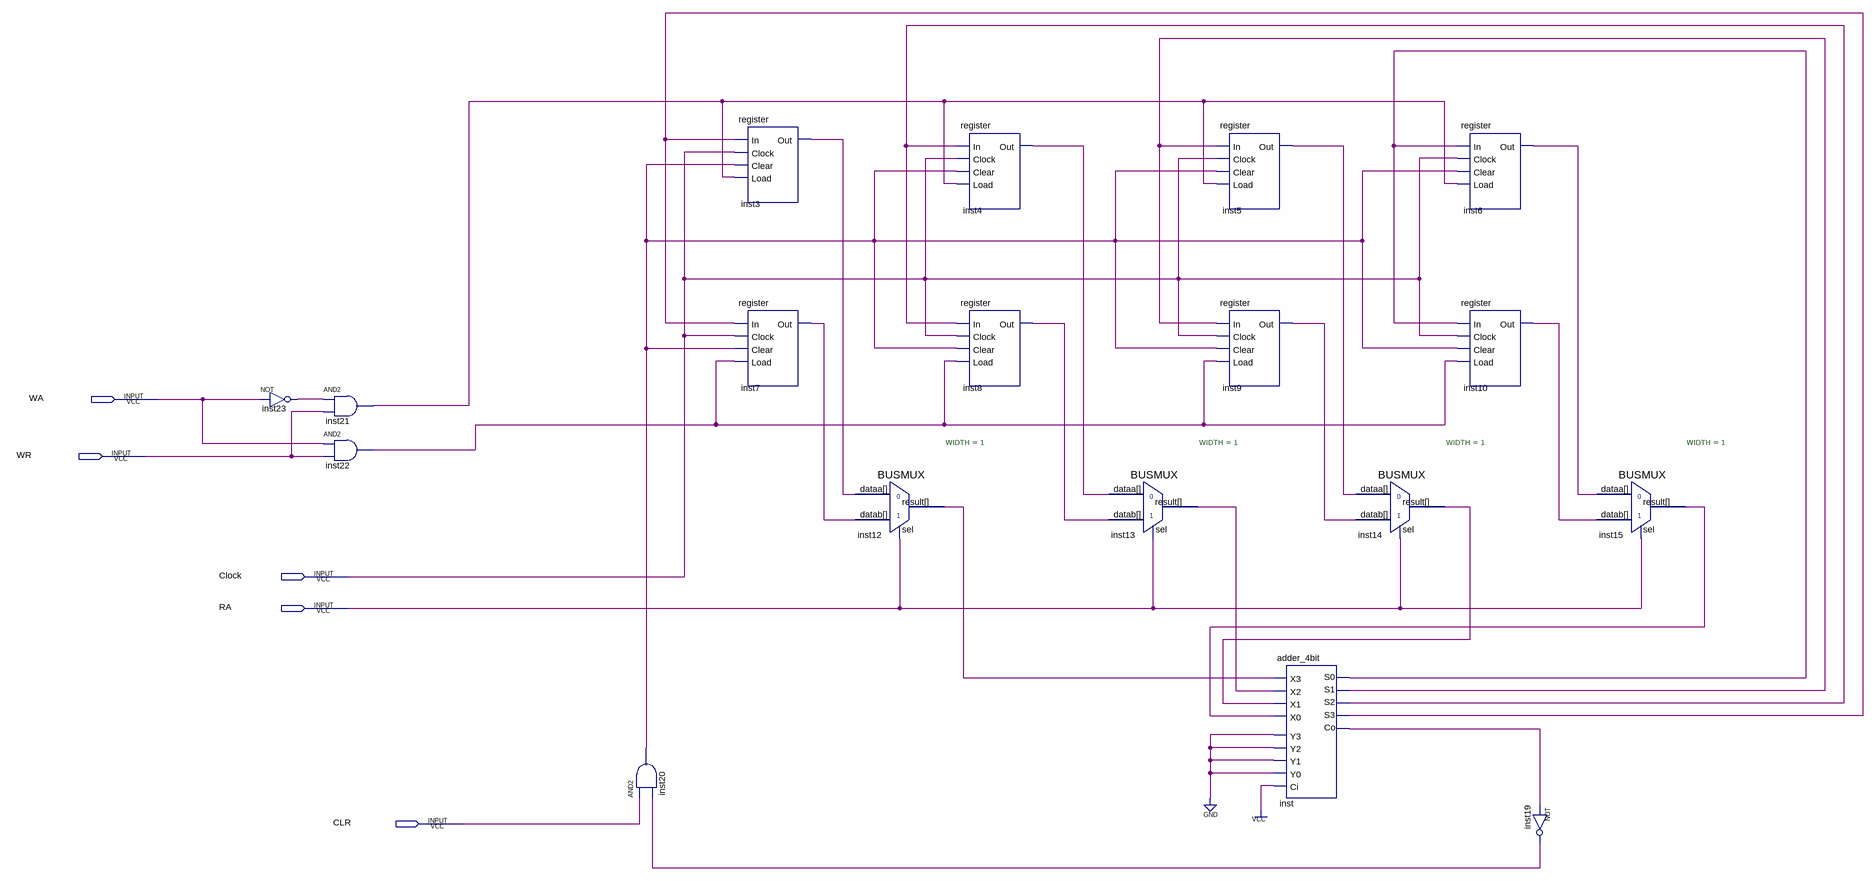
[diagram p0: schematic sheet]
// Quartus schematic Block4.bdf as structural Verilog: 18 symbols, 5 pins
module Block4 (
  input  WA,
  input  WR,
  input  Clock,
  input  RA,
  input  CLR
);

  wire inst3_out, inst4_out, inst5_out, inst6_out, inst7_out, inst8_out, inst9_out, inst10_out,
       inst12_result, inst13_result, inst14_result, inst15_result, inst19_out, inst20_out, inst21_out,
       inst22_out, inst23_out, inst_co, inst_s0, inst_s1, inst_s2, inst_s3;

  not inst23 (inst23_out, WA);
  and inst21 (inst21_out, inst23_out, WR);
  and inst22 (inst22_out, WA, WR);
  and inst20 (inst20_out, CLR, inst19_out);
  register inst3 (.In(inst_s3), .Clock(Clock), .Clear(inst20_out), .Load(inst21_out), .Out(inst3_out));
  register inst7 (.In(inst_s3), .Clock(Clock), .Clear(inst20_out), .Load(inst22_out), .Out(inst7_out));
  BUSMUX #(.WIDTH(1)) inst12 (.datab(inst7_out), .sel(RA), .dataa(inst3_out), .result(inst12_result));
  register inst4 (.In(inst_s2), .Clock(Clock), .Clear(inst20_out), .Load(inst21_out), .Out(inst4_out));
  register inst8 (.In(inst_s2), .Clock(Clock), .Clear(inst20_out), .Load(inst22_out), .Out(inst8_out));
  BUSMUX #(.WIDTH(1)) inst13 (.datab(inst8_out), .sel(RA), .dataa(inst4_out), .result(inst13_result));
  register inst5 (.In(inst_s1), .Clock(Clock), .Clear(inst20_out), .Load(inst21_out), .Out(inst5_out));
  register inst9 (.In(inst_s1), .Clock(Clock), .Clear(inst20_out), .Load(inst22_out), .Out(inst9_out));
  adder_4bit inst (
    .X3(inst12_result), .Y3(1'b0), .X2(inst13_result), .Y2(1'b0), .X1(inst14_result), .Y1(1'b0),
    .X0(inst15_result), .Y0(1'b0), .Ci(1'b1), .S0(inst_s0), .S1(inst_s1), .S2(inst_s2), .S3(inst_s3),
    .Co(inst_co));
  BUSMUX #(.WIDTH(1)) inst14 (.datab(inst9_out), .sel(RA), .dataa(inst5_out), .result(inst14_result));
  register inst6 (.In(inst_s0), .Clock(Clock), .Clear(inst20_out), .Load(inst21_out), .Out(inst6_out));
  register inst10 (.In(inst_s0), .Clock(Clock), .Clear(inst20_out), .Load(inst22_out), .Out(inst10_out));
  not inst19 (inst19_out, inst_co);
  BUSMUX #(.WIDTH(1)) inst15 (.datab(inst10_out), .sel(RA), .dataa(inst6_out), .result(inst15_result));
endmodule
